# EAGLE design zegarek_v1.6 (EAGLE 6.2)
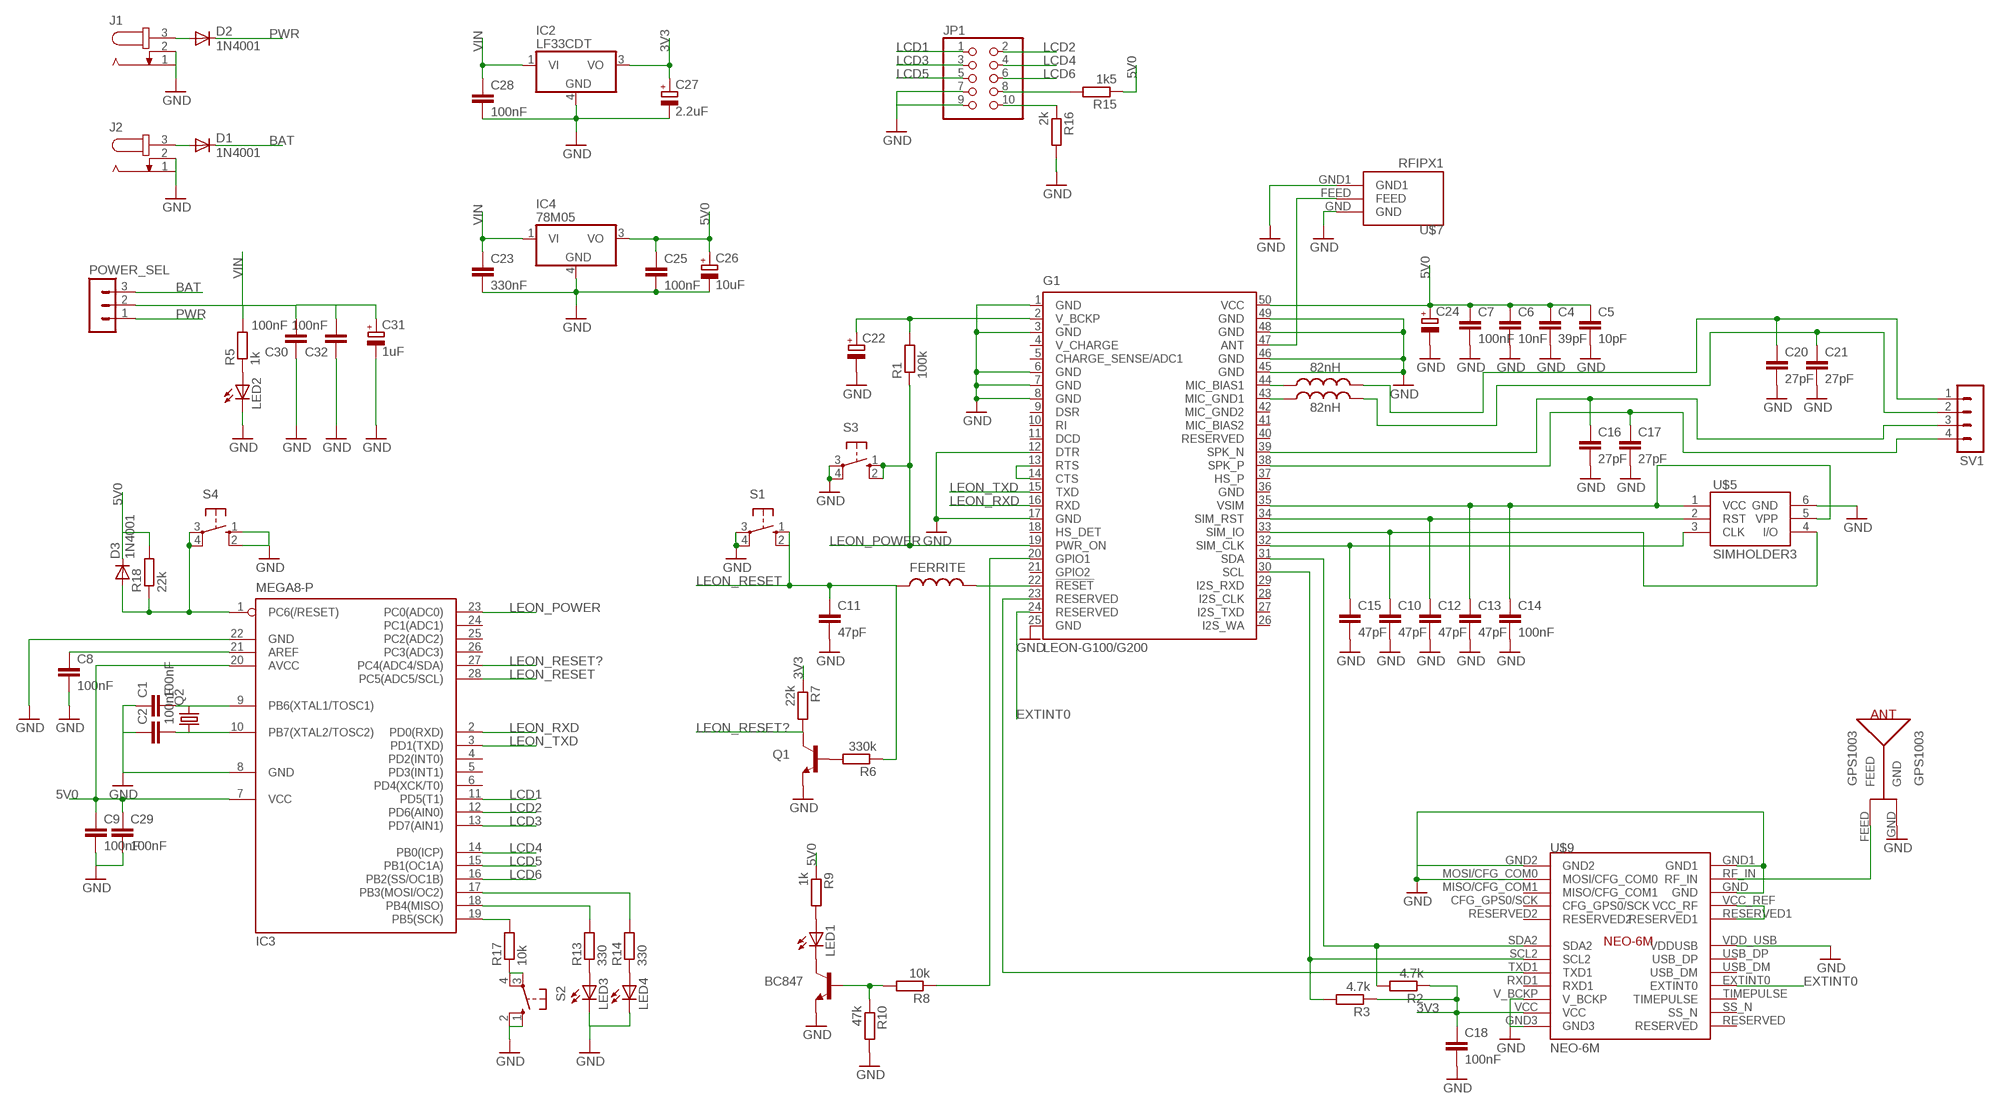
[diagram p0: schematic, sheet 1]

## Parts
BC847  TRANSISTOR_NPNSOT23  [SOT23]
C1  100nF  C-EU025-025X050  [C025-025X050]
C2  100nF  C-EU025-025X050  [C025-025X050]
C4  39pF  C-EU025-025X050  [C025-025X050]
C5  10pF  C-EU025-025X050  [C025-025X050]
C6  10nF  C-EU025-025X050  [C025-025X050]
C7  100nF  C-EU025-025X050  [C025-025X050]
C8  100nF  C-EU025-025X050  [C025-025X050]
C9  100nF  C-EU025-025X050  [C025-025X050]
C10  47pF  C-EU025-025X050  [C025-025X050]
C11  47pF  C-EU025-025X050  [C025-025X050]
C12  47pF  C-EU025-025X050  [C025-025X050]
C13  47pF  C-EU025-025X050  [C025-025X050]
C14  100nF  C-EU025-025X050  [C025-025X050]
C15  47pF  C-EU025-025X050  [C025-025X050]
C16  27pF  C-EU025-025X050  [C025-025X050]
C17  27pF  C-EU025-025X050  [C025-025X050]
C18  100nF  C-EU025-025X050  [C025-025X050]
C20  27pF  C-EU025-025X050  [C025-025X050]
C21  27pF  C-EU025-025X050  [C025-025X050]
C22  CPOL-EUE2,5-6E  [E2,5-6E]
C23  330nF  C-EU025-025X050  [C025-025X050]
C24  CPOL-EUE2,5-6E  [E2,5-6E]
C25  100nF  C-EU025-025X050  [C025-025X050]
C26  10uF  CPOL-EUE2,5-6E  [E2,5-6E]
C27  2.2uF  CPOL-EUE2,5-6E  [E2,5-6E]
C28  100nF  C-EU025-025X050  [C025-025X050]
C29  100nF  C-EU025-025X050  [C025-025X050]
C30  100nF  C-EU025-025X050  [C025-025X050]
C31  1uF  CPOL-EUE2.5-5  [E2,5-5]
C32  100nF  C-EU025-025X050  [C025-025X050]
D1  1N4001  1N4004  [DO41-10]
D2  1N4001  1N4004  [DO41-10]
D3  1N4001  1N4004  [DO41-10]
FERRITE  INDUCTOR0805  [0805]
FERRITE1  82nH  INDUCTOR0805  [0805]
FERRITE2  82nH  INDUCTOR0805  [0805]
G1  LEON-G100/G200  [LEON-G100/G200]
GPS1003  GPS1003  [GPS1003]
IC2  LF33CDT  NCV78M05BDTRKG  [DPACK_3]
IC3  MEGA8-P  [DIL28-3]
IC4  78M05  NCV78M05BDTRKG  [DPACK_3]
J1  JACK-PLUG0  [SPC4077]
J2  JACK-PLUG0  [SPC4077]
JP1  PINHD-2X5  [2X05]
LED1  LED3MM  [LED3MM]
LED2  LED3MM  [LED3MM]
LED3  LED3MM  [LED3MM]
LED4  LED3MM  [LED3MM]
POWER_SEL  MA03-1  [MA03-1]
Q1  TRANSISTOR_NPNSOT23  [SOT23]
Q2  CRYSTALHC49U-V  [HC49U-V]
R1  100k  R-EU_0207/10  [0207/10]
R2  4.7k  R-EU_0207/10  [0207/10]
R3  4.7k  R-EU_0207/10  [0207/10]
R5  1k  R-EU_0207/10  [0207/10]
R6  330k  R-EU_0207/10  [0207/10]
R7  22k  R-EU_0207/10  [0207/10]
R8  10k  R-EU_0207/10  [0207/10]
R9  1k  R-EU_0207/10  [0207/10]
R10  47k  R-EU_0207/10  [0207/10]
R13  330  R-EU_0207/10  [0207/10]
R14  330  R-EU_0207/10  [0207/10]
R15  1k5  R-EU_0207/10  [0207/10]
R16  2k  R-EU_0207/10  [0207/10]
R17  10k  R-EU_0207/10  [0207/10]
R18  22k  R-EU_0207/10  [0207/10]
S1  10-XX  [B3F-10XX]
S2  10-XX  [B3F-10XX]
S3  10-XX  [B3F-10XX]
S4  10-XX  [B3F-10XX]
SV1  MA04-1  [MA04-1]
U$5  SIMHOLDER3  [SIMHOLDER3]
U$7  RFIPX1  [RF-IPX1]
U$9  NEO-6M  [NEO-6M]

## Nets
3V3: C18.1 C27.+ IC2.3(VO) R2.1 R3.1 R7.1 U$9.VCC
5V0: C4.1 C5.1 C6.1 C7.1 C9.1 C24.+ C25.1 C26.+ C29.1 D3.C G1.50(VCC) IC3.7(VCC) IC3.20(AVCC) IC4.3(VO) R9.1 R15.1 R18.2
BAT: D1.C POWER_SEL.3
EXTINT0: G1.24(RESERVED) U$9.EXTINT0
GND: BC847.2(E) C1.1 C2.1 C4.2 C5.2 C6.2 C7.2 C8.2 C9.2 C10.2 C11.2 C12.2 C13.2 C14.2 C15.2 C16.2 C17.2 C18.2 C20.2 C21.2 C22.- C23.2 C24.- C25.2 C26.- C27.- C28.2 C29.2 C30.1 C31.- C32.1 G1.1(GND) G1.3(GND) G1.6(GND) G1.7(GND) G1.8(GND) G1.12(DTR) G1.17(GND) G1.25(GND) G1.45(GND) G1.46(GND) G1.48(GND) G1.49(GND) GPS1003.GND IC2.4(GND) IC3.8(GND) IC3.22(GND) IC4.4(GND) J1.1 J1.2 J2.1 J2.2 JP1.7 JP1.9 LED2.K(C) LED3.K(C) LED4.K(C) Q1.2(E) R10.2 R16.2 S1.3(P) S1.4(P1) S2.1(S) S2.2(S1) S3.3(P) S3.4(P1) S4.1(S) S4.2(S1) U$5.6(GND) U$7.GND U$7.GND1 U$9.GND U$9.GND1 U$9.GND2 U$9.GND3 U$9.MOSI/CFG_COM0 U$9.V_BCKP U$9.VDD_USB(VDDUSB)
LCD1: IC3.11(PD5(T1)) JP1.1
LCD2: IC3.12(PD6(AIN0)) JP1.2
LCD3: IC3.13(PD7(AIN1)) JP1.3
LCD4: IC3.14(PB0(ICP)) JP1.4
LCD5: IC3.15(PB1(OC1A)) JP1.5
LCD6: IC3.16(PB2(SS/OC1B)) JP1.6
LEON_POWER: G1.19(PWR_ON) IC3.23(PC0(ADC0)) R1.1 S3.1(S) S3.2(S1)
LEON_RESET: C11.1 FERRITE.1 IC3.28(PC5(ADC5/SCL)) R6.1 S1.1(S) S1.2(S1)
LEON_RESET?: IC3.27(PC4(ADC4/SDA)) Q1.3(C) R7.2
LEON_RXD: G1.16(RXD) IC3.2(PD0(RXD))
LEON_TXD: G1.15(TXD) IC3.3(PD1(TXD))
N$1: FERRITE.2 G1.22(!RESET)
N$2: R17.1 S2.3(P) S2.4(P1)
N$3: C22.+ G1.2(V_BCKP) R1.2
N$4: C13.1 C14.1 G1.35(VSIM) U$5.1(VCC) U$5.5(VPP)
N$5: C15.1 G1.32(SIM_CLK) U$5.3(CLK)
N$6: C12.1 G1.34(SIM_RST) U$5.2(RST)
N$7: C16.1 G1.39(SPK_N) SV1.3
N$8: C10.1 G1.33(SIM_IO) U$5.4(I/O)
N$9: C17.1 G1.38(SPK_P) SV1.4
N$10: G1.13(RTS) G1.14(CTS)
N$11: FERRITE1.1 G1.44(MIC_BIAS1)
N$12: FERRITE2.1 G1.43(MIC_GND1)
N$13: C20.1 FERRITE1.2 SV1.1
N$14: C21.1 FERRITE2.2 SV1.2
N$15: Q1.1(B) R6.2
N$16: BC847.1(B) R8.2 R10.1
N$17: LED1.A R9.2
N$18: BC847.3(C) LED1.K(C)
N$19: G1.20(GPIO1) R8.1
N$20: G1.47(ANT) U$7.FEED
N$21: D2.A J1.3
N$22: IC3.19(PB5(SCK)) R17.2
N$23: GPS1003.FEED U$9.RF_IN
N$24: G1.31(SDA) R2.2 U$9.SDA2
N$25: U$9.RESERVED1 U$9.VCC_REF(VCC_RF)
N$26: G1.30(SCL) R3.2 U$9.SCL2
N$27: G1.23(RESERVED) U$9.TXD1
N$28: IC3.18(PB4(MISO)) R13.2
N$29: IC3.17(PB3(MOSI/OC2)) R14.2
N$30: C1.2 IC3.9(PB6(XTAL1/TOSC1)) Q2.2
N$31: LED2.A R5.1
N$32: C2.2 IC3.10(PB7(XTAL2/TOSC2)) Q2.1
N$33: C8.1 IC3.21(AREF)
N$34: D1.A J2.3
N$35: LED3.A R13.1
N$36: LED4.A R14.1
N$37: JP1.10 R16.1
N$38: JP1.8 R15.2
N$39: D3.A IC3.1(PC6(/RESET)) R18.1 S4.3(P) S4.4(P1)
PWR: D2.C POWER_SEL.1
VIN: C23.1 C28.1 C30.2 C31.+ C32.2 IC2.1(VI) IC4.1(VI) POWER_SEL.2 R5.2
Unconnected: G1.4(V_CHARGE) G1.5(CHARGE_SENSE/ADC1) G1.9(DSR) G1.10(RI) G1.11(DCD) G1.18(HS_DET) G1.21(GPIO2) G1.26(I2S_WA) G1.27(I2S_TXD) G1.28(I2S_CLK) G1.29(I2S_RXD) G1.37(HS_P) G1.40(RESERVED) G1.41(MIC_BIAS2) G1.42(MIC_GND2) IC3.4(PD2(INT0)) IC3.5(PD3(INT1)) IC3.6(PD4(XCK/T0)) IC3.24(PC1(ADC1)) IC3.25(PC2(ADC2)) IC3.26(PC3(ADC3)) U$9.CFG_GPS0/SCK U$9.MISO/CFG_COM1 U$9.RESERVED U$9.RESERVED2 U$9.RXD1 U$9.SS_N U$9.TIMEPULSE U$9.USB_DM U$9.USB_DP

## Power pins joined to a net without a drawn wire
GND: G1.36(GND)

## Library data of the parts
BC847 Q1 = SparkFun:TRANSISTOR_NPN: Transistor NPN BJT configuration in SOT23 package. MMBT2222 is the common NPN we use. Double check BCE configuration again layout.
C1 C2 C4-C18 C20 C21 C23 C25 C28-C30 C32 = rcl:C-EU: CAPACITOR, European symbol
C22 C24 C26 C27 C31 = rcl:CPOL-EU: POLARIZED CAPACITOR, European symbol
D1-D3 = diode:1N4004: DIODE general purpose rectifier, 1 A
FERRITE FERRITE1 FERRITE2 = SparkFun:INDUCTOR: Inductors Basic Inductor/Choke - 0603 and 1206. Footprints are not proven and vary greatly between part numbers.
G1 = u-blox-1:LEON-G100/G200: LEON-G100/G200 Quad Band GSM/GPRS Voice and Data Modules Source: http://www.u-blox.com; OC_FARNELL: unknown; OC_NEWARK: unknown
GPS1003 = u-blox_NEO-6M:GPS1003
IC2 IC4 = linear:NCV78M: 500 mA Positive Voltage Regulators Source: Data sheet <http://www.onsemi.com/pub_link/Collateral/MC78M00-D.PDF>
IC3 = atmel:MEGA8-P: MICROCONTROLLER 8 Kbytes FLASH, 1 kbytes SRAM, 512 bytes EEPROM, USART, 4-channel 10 bit ADC, 2-channel 8 bit ADC Pin compatible with Atmega48, ATMega88, ATMega168 Source: avr.lbr; OC_FARNELL: unknown; OC_NEWARK: unknown
J1 J2 = con-jack:JACK-PLUG: DC POWER JACK Power Jack, DC, Right Angle, Through Hole, Rated 5A at 16VDC, PC Terminals Distributor: Farnell (www.Farnell.de) Drawing: 84N1161.pdf / 84N1162.pdf Manufacturer: SPC Technology (www.spctechnology.com) Type: SPC4077 / SPC 4078; OC_FARNELL: unknown; OC_NEWARK: unknown
JP1 = pinhead:PINHD-2X5: PIN HEADER
LED1-LED4 = led:LED: LED OSRAM: - CHIPLED LG R971, LG N971, LY N971, LG Q971, LY Q971, LO R971, LY R971 LH N974, LH R974 LS Q976, LO Q976, LY Q976 LO Q996 - Hyper CHIPLED LW Q18S LB Q993, LB Q99A, LB R99A - SideLED LS A670, LO A670, LY A670, LG A670, LP A670 LB A673, LV A673, LT A673, LW A673 LH A674 LY A675 LS A676, LA A676, LO A676, LY A676, LW A676 LS A679, LY A679, LG A679 - Hyper Micro SIDELED® LS Y876, LA Y876, LO Y876, LY Y876 LT Y87S - SmartLED LW L88C, LW L88S LB L89C, LB L89S, LG L890 LS L89K, LO L89K, LY L89K LS L896, LA L896, LO L896, LY L896 - TOPLED LS T670, LO T670, LY T670, LG T670, LP T670 LSG T670, LSP T670, LSY T670, LOP T670, LYG T670 LG T671, LOG T671, LSG T671 LB T673, LV T673, LT T673, LW T673 LH T674 LS T676, LA T676, LO T676, LY T676, LB T676, LH T676, LSB T676, LW T676 LB T67C, LV T67C, LT T67C, LS T67K, LO T67K, LY T67K, LW E67C LS E67B, LA E67B, LO E67B, LY E67B, LB E67C, LV E67C, LT E67C LW T67C LS T679, LY T679, LG T679 LS T770, LO T770, LY T770, LG T770, LP T770 LB T773, LV T773, LT T773, LW T773 LH T774 LS E675, LA E675, LY E675, LS T675 LS T776, LA T776, LO T776, LY T776, LB T776 LHGB T686 LT T68C, LB T68C - Hyper Mini TOPLED® LB M676 - Mini TOPLED Santana® LG M470 LS M47K, LO M47K, LY M47K Source: http://www.osram.convergy.de LUXEON: - LUMILED® LXK2-PW12-R00, LXK2-PW12-S00, LXK2-PW14-U00, LXK2-PW14-V00 LXK2-PM12-R00, LXK2-PM12-S00, LXK2-PM14-U00 LXK2-PE12-Q00, LXK2-PE12-R00, LXK2-PE12-S00, LXK2-PE14-T00, LXK2-PE14-U00 LXK2-PB12-K00, LXK2-PB12-L00, LXK2-PB12-M00, LXK2-PB14-N00, LXK2-PB14-P00, LXK2-PB14-Q00 LXK2-PR12-L00, LXK2-PR12-M00, LXK2-PR14-Q00, LXK2-PR14-R00 LXK2-PD12-Q00, LXK2-PD12-R00, LXK2-PD12-S00 LXK2-PH12-R00, LXK2-PH12-S00 LXK2-PL12-P00, LXK2-PL12-Q00, LXK2-PL12-R00 Source: www.luxeon.com KINGBRIGHT: KA-3528ASYC Source: www.kingbright.com
POWER_SEL = con-lstb:MA03-1: PIN HEADER; OC_FARNELL: unknown; OC_NEWARK: unknown
Q2 = crystal:CRYSTAL: CRYSTAL; OC_FARNELL: 1666969; OC_NEWARK: unknown
R1-R3 R5-R10 R13-R18 = rcl:R-EU_: RESISTOR, European symbol
S1-S4 = switch-omron:10-XX: OMRON SWITCH; MPN: B3F-1000; OC_FARNELL: 176432; OC_NEWARK: 36M3542
SV1 = con-lstb:MA04-1: PIN HEADER; OC_FARNELL: unknown; OC_NEWARK: unknown
U$5 = SparkFun:SIMHOLDER3
U$7 = RFIPX:RFIPX1
U$9 = u-blox_NEO-6M:NEO-6M

## Net classes
0 default: width 0.203 mm

## Board
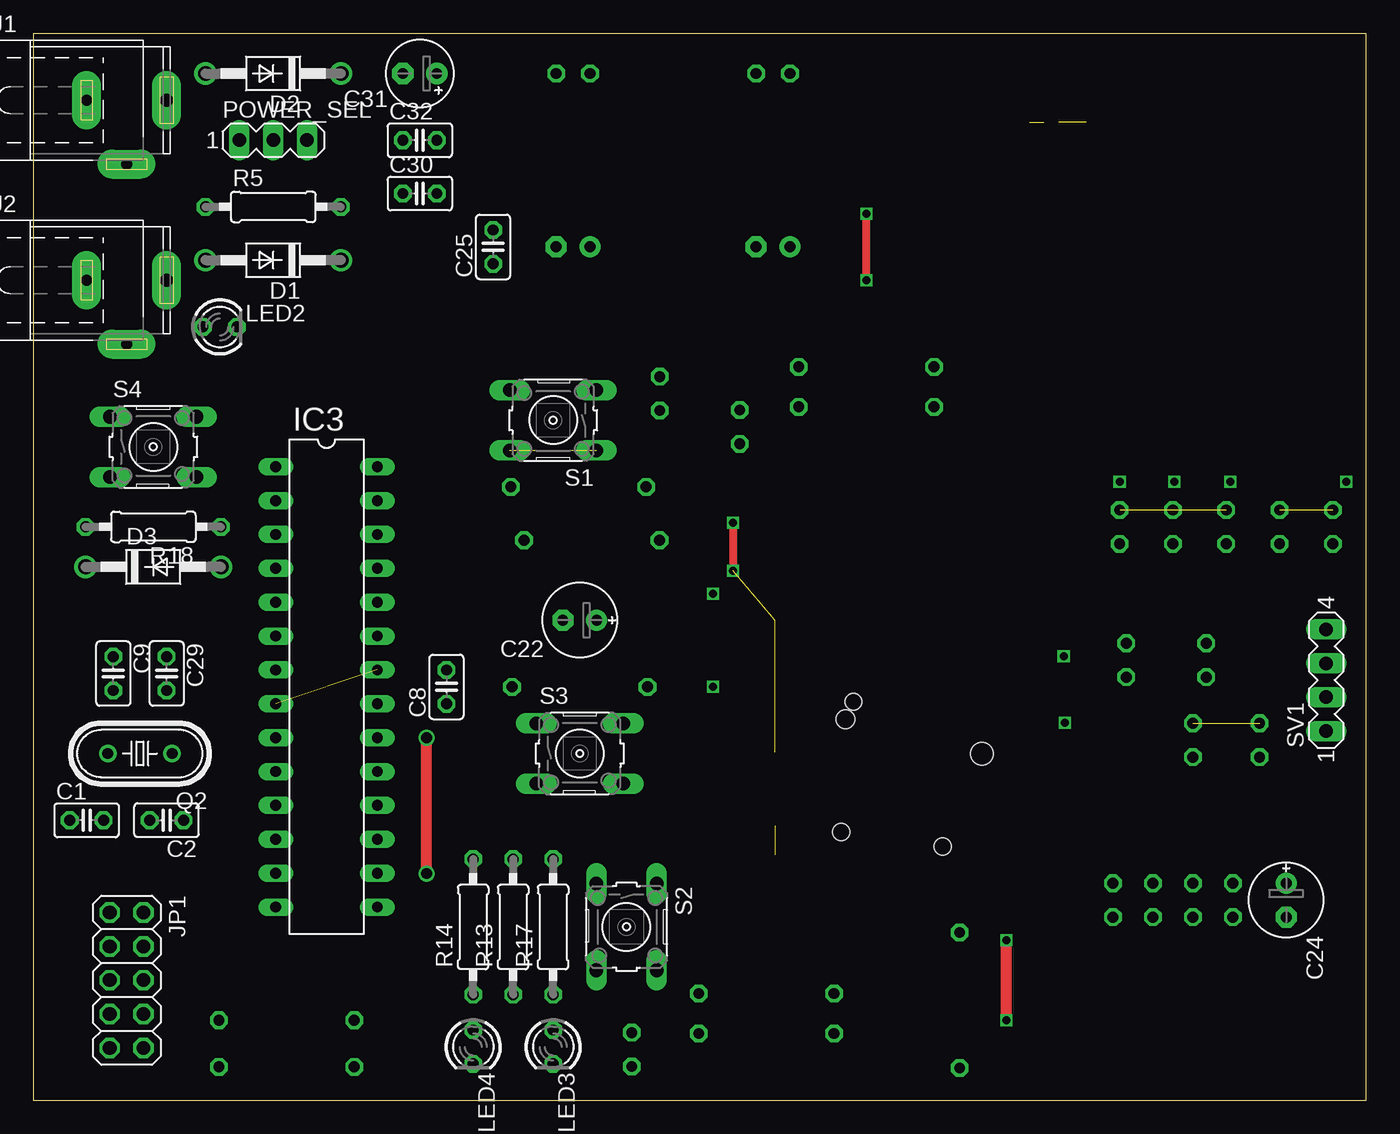
[diagram p1: board, top side]
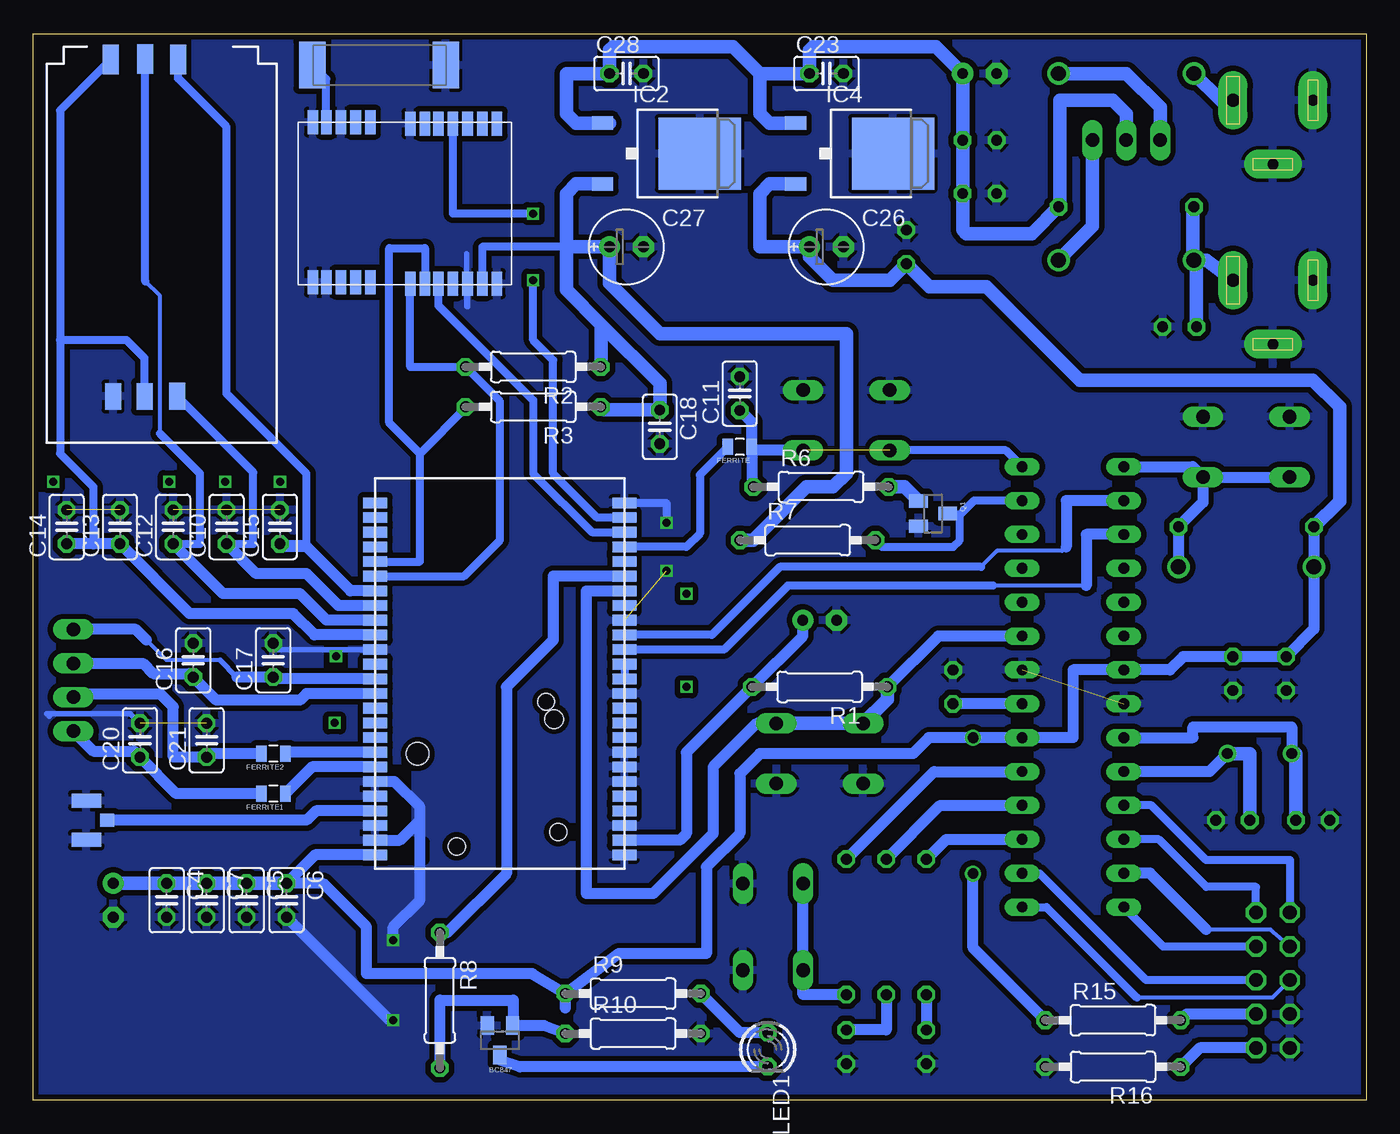
[diagram p2: board, bottom side, seen from below]

Size 100 x 80 mm. Coordinates in mm from the lower left corner, seen from the top.
Outline: 0,0 100,0 100,80 0,80 0,0
Copper layers (1*16): Top 0.035mm / dielectric 1.5mm / Bottom 0.035mm
Design rules: minimum track width 6mil, minimum drill 12mil, track to track 6mil, track to pad 6mil, pad to pad 6mil, via to via 6mil, smd to smd 0mil, copper to edge 10mil, drill to drill 10mil, minimum pad ring 10mil, minimum via ring 6mil, stop-mask expansion 2mil, vias tented up to drill 100mil, thermal gap 10mil

### Footprints (pad centres in the part's own frame; a part is rotated, then mirrored left to right if it is on the bottom)
SOT23 = smd 1 x 1.4: 1 -0.95,-1.1; 2 0.95,-1.1; 3 0,1.1
C025-025X050 = drill 0.813 octagon: 1 -1.27,0; 2 1.27,0
E2,5-6E = drill 0.813 pad 1.575: + -1.27,0 | drill 0.813 pad 1.575 octagon: - 1.27,0
E2,5-5 = drill 0.813 pad 1.6: + -1.27,0 | drill 0.813 pad 1.6 octagon: - 1.27,0
DO41-10 = drill 1.118: A 5.08,0; C -5.08,0
0805 = smd 0.8 x 1.2: 1 -0.9,0; 2 0.9,0
LEON-G100/G200 = smd 1.8 x 0.8: 1 -9.35,13.6; 2 -9.35,12.5; 3 -9.35,11.4; 4 -9.35,10.3; 5 -9.35,9.2; 6 -9.35,8.1; 7 -9.35,7; 8 -9.35,5.9; 9 -9.35,4.8; 10 -9.35,3.7; 11 -9.35,2.6; 12 -9.35,1.5; 13 -9.35,0.4; 14 -9.35,-0.7; 15 -9.35,-1.8; 16 -9.35,-2.9; 17 -9.35,-4; 18 -9.35,-5.1; 19 -9.35,-6.2; 20 -9.35,-7.3; 21 -9.35,-8.4; 22 -9.35,-9.5; 23 -9.35,-10.6; 24 -9.35,-11.7; 25 -9.35,-12.8; 26 9.35,-12.8; 27 9.35,-11.7; 28 9.35,-10.6; 29 9.35,-9.5; 30 9.35,-8.4; 31 9.35,-7.3; 32 9.35,-6.2; 33 9.35,-5.1; 34 9.35,-4; 35 9.35,-2.9; 36 9.35,-1.8; 37 9.35,-0.7; 38 9.35,0.4; 39 9.35,1.5; 40 9.35,2.6; 41 9.35,3.7; 42 9.35,4.8; 43 9.35,5.9; 44 9.35,7; 45 9.35,8.1; 46 9.35,9.2; 47 9.35,10.3; 48 9.35,11.4; 49 9.35,12.5; 50 9.35,13.6 | hole 1.31: -4.39,11.88 | hole 1.29: 3.23,12.96 | hole 1.7: 6.16,6.02 | hole 1.4: -4.07,3.42 | hole 1.24: -3.47,2.12
GPS1003 = smd 3.5 x 2: FEED 0.23,4.96; GND 0.23,-5.04
DPACK_3 = smd 1 x 1.6: 1 -2.28,-4.8; 3 2.28,-4.8 | smd 5.4 x 6.2: 4 0,2.5
DIL28-3 = drill 0.813 long: 1 -16.51,-3.81; 2 -13.97,-3.81; 3 -11.43,-3.81; 4 -8.89,-3.81; 5 -6.35,-3.81; 6 -3.81,-3.81; 7 -1.27,-3.81; 8 1.27,-3.81; 9 3.81,-3.81; 10 6.35,-3.81; 11 8.89,-3.81; 12 11.43,-3.81; 13 13.97,-3.81; 14 16.51,-3.81; 15 16.51,3.81; 16 13.97,3.81; 17 11.43,3.81; 18 8.89,3.81; 19 6.35,3.81; 20 3.81,3.81; 21 1.27,3.81; 22 -1.27,3.81; 23 -3.81,3.81; 24 -6.35,3.81; 25 -8.89,3.81; 26 -11.43,3.81; 27 -13.97,3.81; 28 -16.51,3.81
SPC4077 = drill 0.8 pad 2.184 long: 1 -3,0; 2 0,-4.8 | drill 1 pad 2.184 long: 3 3,0
2X05 = drill 1.016 octagon: 1 -5.08,-1.27; 2 -5.08,1.27; 3 -2.54,-1.27; 4 -2.54,1.27; 5 0,-1.27; 6 0,1.27; 7 2.54,-1.27; 8 2.54,1.27; 9 5.08,-1.27; 10 5.08,1.27
LED3MM = drill 0.813 octagon: A -1.27,0; K 1.27,0
MA03-1 = drill 1.016 long: 1 -2.54,0; 2 0,0; 3 2.54,0
HC49U-V = drill 0.813: 1 -2.413,0; 2 2.413,0
0207/10 = drill 0.813 octagon: 1 -5.08,0; 2 5.08,0
B3F-10XX = drill 1.016 long: 1 -3.251,2.261; 2 3.251,2.261; 3 -3.251,-2.261; 4 3.251,-2.261
MA04-1 = drill 1.016 long: 1 -3.81,0; 2 -1.27,0; 3 1.27,0; 4 3.81,0
SIMHOLDER3 = smd 2.2 x 1.2: 1 0.95,4.81; 2 0.91,7.41; 3 0.95,9.86 | smd 2 x 1.2: 4 26.2,9.78; 5 26.22,7.34; 6 26.22,4.98
RF-IPX1 = smd 1 x 1.05: FEED 0,-1.05 | smd 1.05 x 2.2: GND 1.475,0.525; GND1 -1.475,0.525
NEO-6M = smd 0.8 x 1.8: CFG_GPS0/SCK -3.32,-6.15; EXTINT0 3.98,5.75; GND -4.42,5.85; GND1 -6.52,5.85; GND2 -6.52,-6.15; GND3 7.28,-6.25; MISO/CFG_COM1 -4.42,-6.15; MOSI/CFG_COM0 -5.52,-6.15; RESERVED 7.28,5.75; RESERVED1 -2.22,5.85; RESERVED2 -2.22,-6.15; RF_IN -5.52,5.85; RXD1 3.98,-6.25; SCL2 1.88,-6.25; SDA2 0.78,-6.25; SS_N 6.18,5.75; TIMEPULSE 5.08,5.75; TXD1 2.88,-6.25; USB_DM 2.88,5.75; USB_DP 1.88,5.75; V_BCKP 5.08,-6.25; VCC 6.18,-6.25; VCC_REF -3.32,5.85; VDD_USB 0.78,5.75

### Placement (x,y rotation side)
BC847  65,4.5 180 bottom
C1  4,21 0 top
C2  10,21 180 top
C4  90,15 270 bottom
C5  84,15 270 bottom
C6  81,15 270 bottom
C7  87,15 270 bottom
C8  31,31 90 top
C9  6,32 270 top
C10  85.5,43 90 bottom
C11  47,53 90 bottom
C12  89.5,43 90 bottom
C13  93.5,43 90 bottom
C14  97.5,43 90 bottom
C15  81.5,43 90 bottom
C16  88,33 90 bottom
C17  82,33 90 bottom
C18  53,50.5 270 bottom
C20  92,27 90 bottom
C21  87,27 90 bottom
C22  41,36 180 top
C23  40.5,77 0 bottom
C24  94,15 270 top
C25  34.5,64 90 top
C26  40.5,64 0 bottom
C27  55.5,64 0 bottom
C28  55.5,77 0 bottom
C29  10,32 270 top
C30  29,68 0 top
C31  29,77 180 top
C32  29,72 0 top
D1  18,63 180 top
D2  18,77 180 top
D3  9,40 0 top
FERRITE  47,49 180 bottom
FERRITE1  82,23 180 bottom
FERRITE2  82,26 180 bottom
G1  65,32 180 bottom
GPS1003  74.1,77.4 90 bottom
IC2  52.5,71 270 bottom
IC3  22,31 270 top
IC4  38,71 270 bottom
J1  7,75 0 top
J2  7,61.5 0 top
JP1  7,9 270 top
LED1  44.9,3.8 270 bottom
LED2  14,58 0 top
LED3  39,4 270 top
LED4  33,4 270 top
POWER_SEL  18,72 0 top
Q1  32.5,44 270 bottom
Q2  8,26 180 top
R1  41,31 180 bottom
R2  62.5,55 180 bottom
R3  62.5,52 180 bottom
R5  18,67 0 top
R6  40.9,46 0 bottom
R7  41.9,42 0 bottom
R8  69.5,7.5 270 bottom
R9  55,8 0 bottom
R10  55,5 0 bottom
R13  36,13 90 top
R14  33,13 90 top
R15  19,6 0 bottom
R16  19,2.5 180 bottom
R17  39,13 90 top
R18  9,43 180 top
S1  39,51 180 top
S2  44.5,13 270 top
S3  41,26 0 top
S4  9,49 0 top
SV1  97,31.5 90 top
U$5  99,79 270 bottom
U$7  95.5,21 90 bottom
U$9  72.5,67.5 0 bottom

### Tracks (layer width: path | path; a pad name or v marks a point on that pad's centre or on a via)
3V3
  Bottom 0.61: 60,64 66.32,64 U$9.VCC
  Bottom 1.016: 57.3,64 C27.+ | IC2.3 59.28,68.72 60,68 60,64 | 60,64 C27.+ | C27.+ 56.77,61.27 53,57.5 39,57.5 39,47 40,46 42,46 46,42 R7.1 | 60,64 60,60.77 57.37,58.13 | 57.37,58.13 53,53.77 C18.1 57.19,51.77 R3.1 | R2.1 57.42,58.08 57.37,58.13
5V0  (via drill 0.8)
  Top 0.813: v29.5,17 v29.5,27.19
  Bottom 0.813: R18.2 D3.C 3.92,35.35 C9.1 C29.1 13.73,33.27 14.73,32.27 IC3.7 22,32.27 22,27.19 IC3.20 v29.5,27.19 32.81,27.19 34,26 45.5,26 47,24.5 47,20 49.5,17.5 49.5,11 56.08,11 R9.1 | G1.50 78.87,18.4 C6.1 78.27,16.27 75,13 75,9.5 62.58,9.5 R9.1 | R15.1 29.5,11.42 v29.5,17 | 60.08,6.92 R9.1
  Bottom 1.016: IC4.3 44.78,68.72 45.5,68 45.5,64 C26.+ 41.77,63.27 40,61.5 35.73,61.5 C25.1 32.77,61 28.5,61 21.5,54 4,54 2,52 2,44.92 R18.2 | C6.1 C5.1 C7.1 C4.1 C24.+
BAT
  Bottom 1.016: POWER_SEL.3 20.54,65.54 D1.C
EXTINT0  (via drill 0.6)
  Top 0.61: v62.5,61.5 v62.5,66.5
  Bottom 0.61: G1.24 57.7,43.7 61,47 61,55.5 62.5,57 v62.5,61.5 | v62.5,66.5 68.52,66.5 U$9.EXTINT0
GND  (via drill 0.6)  (10 unrouted)
  Top 0.61: v52.5,43.3 v52.5,39.7
  Top 0.813: v73,6 v73,12
  Bottom 0.406: G1.36 82,33.8 C17.2 | C20.2 92.73,29 98.9,29 | 99,29 98.9,29 | 98.9,29 98.8,28.9 98.8,28.8 | U$9.V_BCKP 67.4,61.23 67.4,59.5 67.5,59.6 67.5,63.5
  Bottom 0.61: G1.25 52.5,44.8 v52.5,43.3
  Bottom 0.813: G1.49 72.5,19.5 71,21 | 71,21 71,22 72.9,23.9 G1.45 | C6.2 73.27,6 v73,6 | v73,12 73,13 71,15 71,21
  pour Bottom (isolate 0.406): 0,80 100,80 100,0 0,0
LCD1
  Bottom 0.61: JP1.1 5.73,18 12,18 16.11,22.11 IC3.11
LCD2
  Bottom 0.61: JP1.2 8.27,16 12,16 15.57,19.57 IC3.12
LCD3
  Bottom 0.305: JP1.3 7.19,12.8 12,12.8
  Bottom 0.813: 12,12.8 16.23,17.03 IC3.13
LCD4
  Bottom 0.61: IC3.14 15.24,11.54 JP1.4
LCD5
  Bottom 0.305: JP1.5 7.03,7.7 17.2,7.7
  Bottom 0.61: IC3.15 23.99,14.49 17.2,7.7
LCD6
  Bottom 0.61: JP1.6 16.5,9 24.5,17 25.78,17 IC3.16
LEON_POWER
  Bottom 0.813: IC3.23 32.11,34.81 R1.1 | S3.2 45.74,28.26 49,25 49,20 53.5,15.5 58.5,15.5 58.5,38.2 G1.19
  Bottom 1.016: R1.1 35.92,30.09 S3.1 S3.2
LEON_RESET  (1 unrouted)
  Bottom 0.61: IC3.28 27.04,48.74 S1.2
  Bottom 0.813: FERRITE.1 46.1,50.83 C11.1 | FERRITE.1 46.1,46.12 R6.1 | S1.1 45.84,48.74 FERRITE.1
LEON_RESET?
  Bottom 0.61: 30.5,43.9 30.5,42 31,41.5 36.32,41.5 R7.2 | 30.5,43.9 Q1.3 | IC3.27 29.43,44.97 30.5,43.9
LEON_RXD
  Bottom 0.305: 22.5,41.5 22.8,41.2 27.7,41.2 28.9,40
  Bottom 0.61: 28.9,40 44,40 49.1,34.9 G1.16
  Bottom 0.813: IC3.2 22.5,44.97 22.5,41.5
LEON_TXD
  Bottom 0.305: 21,38.6 28,38.6
  Bottom 0.61: 28,38.6 43.4,38.6 48.2,33.8 G1.15
  Bottom 0.813: IC3.3 21,42.43 21,38.6
N$1
  Bottom 0.61: FERRITE.2 50,46.9 50,42.5 51,41.5 G1.22
N$2
  Bottom 0.813: R17.1 42.24,7.92 S2.4 S2.3
N$3
  Bottom 0.813: C22.+ 42.27,34.81 R1.2 51,26.08 51,20 51.5,19.5 G1.2
N$4
  Bottom 0.61: U$5.1 98,74.24 98,57 | 98,57 98,48.5 95.5,46 95.5,41.73 | U$5.5 91.66,55.66 93,57 98,57
  Bottom 0.813: G1.35 78.9,34.9 80.5,36.5 88.27,36.5 C13.1 95.5,41.73 C14.1
N$5
  Bottom 0.61: C15.1 79.5,41.73 79.5,47 85.5,53 85.5,73 89.14,76.64 U$5.3
  Bottom 0.813: G1.32 76.2,38.2 79.5,41.5 81.5,41.5 C15.1
N$6
  Bottom 0.305: 90.5,50 90.5,60.32 91.59,61.41
  Bottom 0.61: C12.1 87.5,41.73 87.5,47 90.5,50 | 91.59,61.41 U$5.2
  Bottom 0.813: G1.34 78,36 80,38 85.77,38 C12.1
N$7
  Bottom 0.813: G1.39 79.5,30.5 80,30 86.27,30 C16.1 88.27,32 91,32 91.77,32.77 SV1.3
N$8
  Bottom 0.61: C10.1 83.5,41.73 83.5,47.08 U$5.4
  Bottom 0.813: G1.33 77.1,37.1 79.5,39.5 83.27,39.5 C10.1
N$9
  Bottom 0.305: 86,33 90,33 91.5,34.5
  Bottom 0.406: 84.73,31.73 86,33
  Bottom 0.813: G1.38 81.87,31.6 C17.1 84.73,31.73 | 91.5,34.5 92.31,35.31 SV1.4
N$10
  Bottom 0.61: G1.14 G1.13
N$11
  Bottom 0.813: G1.44 79.1,25 FERRITE1.1
N$12
  Bottom 0.813: G1.43 81,26.1 FERRITE2.1
N$13
  Bottom 0.813: FERRITE1.2 89.27,23 C20.1 92.46,26.19 95.5,26.19 SV1.1
N$14
  Bottom 0.813: FERRITE2.2 86.73,26 C21.1 89.5,25.73 89.5,29.5 90.5,30.5 96.73,30.5 SV1.2
N$15
  Bottom 1.016: R6.2 34.65,46 Q1.1
N$16
  Bottom 0.813: R10.1 61.68,5.6 BC847.1 64,5.6 64,7.5 69.5,7.5 R8.2
N$17
  Bottom 0.813: LED1.A 46.99,5.07 R9.2
N$18
  Bottom 0.813: LED1.K 45.93,2.5 63.5,2.5 65,3 BC847.3
N$19
  Bottom 0.813: G1.20 61,39.3 61,34.5 64.5,31 64.5,17 68.92,12.58 R8.1
N$20
  Bottom 0.813: G1.47 78.8,21.7 79.5,21 U$7.FEED
N$21
  Bottom 1.016: J1.3 10.92,75 D2.A
N$22
  Bottom 0.813: R17.2 32.43,24.65 IC3.19
N$23
  Bottom 0.61: U$9.RF_IN 78.02,76.59 GPS1003.FEED
N$24
  Bottom 0.61: U$9.SDA2 71.72,55 R2.2 65,52.42 65,42 67.7,39.3 G1.31
N$25  (1 unrouted)
N$26
  Bottom 0.61: G1.30 71,40.4 71,48.5 | 71,48.5 73.3,50.8 73.3,63.9 70.62,63.9 U$9.SCL2 | R3.2 67.58,51.92 71,48.5
N$27
  Bottom 0.61: U$9.TXD1 69.62,59.62 62.5,52.5 62.5,47 58.1,42.6 G1.23
N$28
  Bottom 0.813: R13.2 31.97,22.11 IC3.18
N$29
  Bottom 0.813: R14.2 31.51,19.57 IC3.17
N$30
  Bottom 0.813: IC3.9 13,27.19 13,28 5.59,28 Q2.2
  Bottom 1.016: C1.2 5.27,26 Q2.2
N$31
  Bottom 1.016: R5.1 13,66.92 13,63 12.73,62.73 LED2.A
N$32
  Bottom 0.813: Q2.1 11.76,24.65 IC3.10
  Bottom 1.016: C2.2 8.73,26 Q2.1
N$33
  Bottom 0.813: IC3.21 C8.1
N$34
  Bottom 1.016: J2.3 12,63 D1.A
N$35
  Bottom 0.813: R13.1 36,5.27 LED3.A
N$36
  Bottom 0.813: R14.1 LED4.A
N$37
  Bottom 0.813: JP1.10 12.5,3.92 R16.1
N$38
  Bottom 0.813: JP1.8 13.46,6.46 R15.2
N$39
  Bottom 0.813: IC3.1 13.02,47.51 S4.4 | S4.4 S4.3 | S4.4 12.25,44.83 R18.1 D3.A
N$40  (via drill 0.6)
  other vias: 51,31
N$41  (via drill 0.6)
  other vias: 51,38
N$42  (via drill 0.6)
  other vias: 77.4,28.3
N$43  (via drill 0.6)
  other vias: 77.3,33.3
N$44  (via drill 0.6)
  other vias: 81.5,46.4
N$45  (via drill 0.6)
  other vias: 85.6,46.4
N$46  (via drill 0.6)
  other vias: 89.8,46.4
N$47  (via drill 0.6)
  other vias: 98.5,46.4
PWR
  Bottom 1.016: D2.C 18,77 15.46,74.46 POWER_SEL.1
VIN
  Bottom 1.016: POWER_SEL.2 18,74 19,75 23,75 23,67.08 R5.2 25.08,65 30,65 30.27,65.27 C30.2 C32.2 C31.+ 32.27,79 41.5,79 41.77,78.73 C23.1 45.5,77 | 45.5,77 45.5,74 44.78,73.28 IC4.1 | 56.77,73.28 IC2.1 59.28,73.28 60,74 60,77 C28.1 56.77,78.77 56.5,79 47.5,79 45.5,77